# Altium schematic sheet mcu.SchDoc
size A3; Scale: 1:1; DocumentType: Схема электрическая принципиальная; FirstReferrence: АБВГ.123456.001
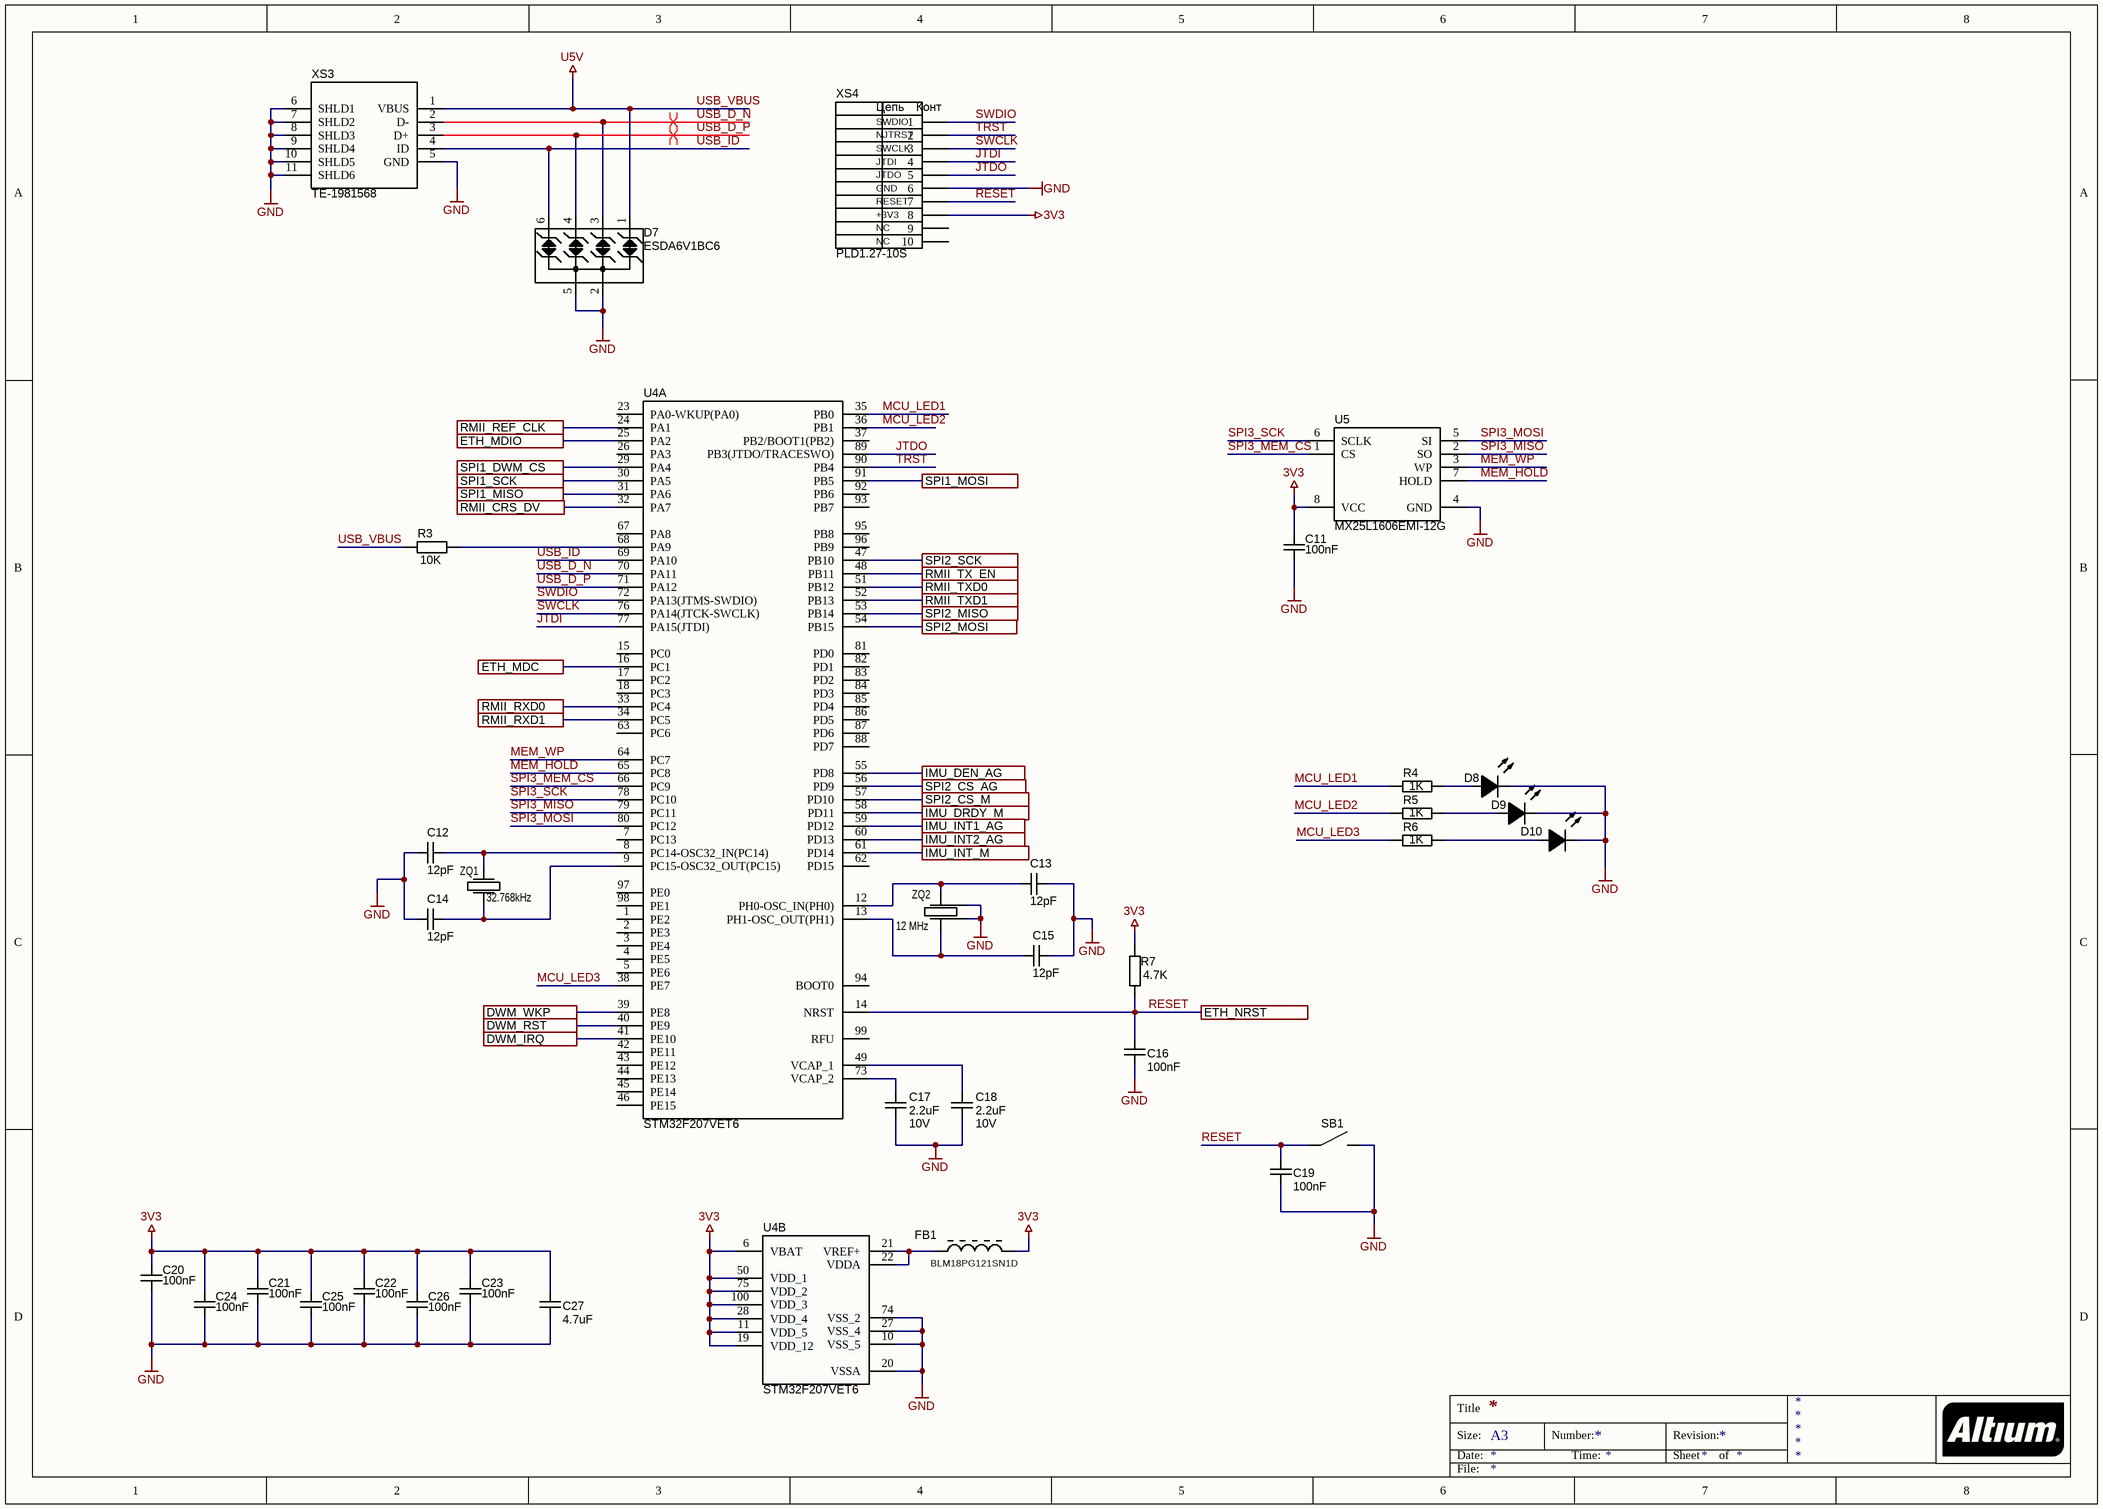
[diagram p0: mcu.SchDoc]

## Parts
C11  value 100nF  [C0603]  (hidden comment: C0603)
C12  value 12pF  [C0603]  (hidden comment: C0603)
C13  value 12pF  [C0603]  (hidden comment: C0603)
C14  value 12pF  [C0603]  (hidden comment: C0603)
C15  value 12pF  [C0603]  (hidden comment: C0603)
C16  value 100nF  [C0603]  (hidden comment: C0603)
C17  value 2.2uF  Voltage: 10V  [C1206(3216)]  (hidden comment: C1206)
C18  value 2.2uF  Voltage: 10V  [C1206(3216)]  (hidden comment: C1206)
C19  value 100nF  [C0603]  (hidden comment: C0603)
C20  value 100nF  [C0603]  (hidden comment: C0603)
C21  value 100nF  [C0603]  (hidden comment: C0603)
C22  value 100nF  [C0603]  (hidden comment: C0603)
C23  value 100nF  [C0603]  (hidden comment: C0603)
C24  value 100nF  [C0603]  (hidden comment: C0603)
C25  value 100nF  [C0603]  (hidden comment: C0603)
C26  value 100nF  [C0603]  (hidden comment: C0603)
C27  value 4.7uF  [C0603]  (hidden comment: C0603)
D7  ESDA6V1BC6  [SOT-23-6]
D8  LED0805  [LED0805]  (value not drawn)
D9  LED0805  [LED0805]  (value not drawn)
D10  LED0805  [LED0805]  (value not drawn)
FB1  BLM18PG121SN1D  [BLM18]
R3  value 10K  [SMD0603]
R4  1K  [SMD0603]
R5  value 1K  [SMD0603]
R6  value 1K  [SMD0603]
R7  value 4.7K  [SMD0603]  (hidden comment: R0603)
SB1  FSMSM  [FSMSM-2]  (value not drawn)
U4  STM32F207VET6  [STM-LQFP100_V]  (parts A,B of 2)
U5  MX25L1606EMI-12G  [SOP-8]
XS3  TE-1981568  [TECO-1981568-5_V]
XS4  PLD1.27-10S  [PLD1.27-10S]
ZQ1  32.768kHz  [DST210A]
ZQ2  12 MHz  [NX3225]

## Ports
DWM_IRQ, DWM_RST, DWM_WKP, ETH_MDC, ETH_MDIO, ETH_NRST, IMU_DEN_AG, IMU_DRDY_M, IMU_INT1_AG, IMU_INT2_AG, IMU_INT_M, RMII_CRS_DV, RMII_REF_CLK, RMII_RXD0, RMII_RXD1, RMII_TX_EN, RMII_TXD0, RMII_TXD1, SPI1_DWM_CS, SPI1_MISO, SPI1_MOSI, SPI1_SCK, SPI2_CS_AG, SPI2_CS_M, SPI2_MISO, SPI2_MOSI, SPI2_SCK

## Nets
3V3: C11.2 C20.2 C21.2 C22.2 C23.2 C24.2 C25.2 C26.2 C27.1 FB1.2 R7.2 U4.6(VBAT) U4.11(VDD_5) U4.19(VDD_12) U4.28(VDD_4) U4.50(VDD_1) U4.75(VDD_2) U4.100(VDD_3) U5.8(VCC) XS4.8
GND: C11.1 C12.1 C13.2 C14.1 C15.2 C16.1 C17.1 C18.1 C19.1 C20.1 C21.1 C22.1 C23.1 C24.1 C25.1 C26.1 C27.2 D7.2(IO2) D7.5(IO4) D8.1(K) D9.1(K) D10.1(K) SB1.2 U4.10(VSS_5) U4.20(VSSA) U4.27(VSS_4) U4.74(VSS_2) U5.4(GND) XS3.5(GND) XS3.6(SHLD1) XS3.7(SHLD2) XS3.8(SHLD3) XS3.9(SHLD4) XS3.10(SHLD5) XS3.11(SHLD6) XS4.6 ZQ2.2 ZQ2.4
USB_VBUS: D7.1(IO1) R3.1 XS3.1(VBUS)  [also labelled U5V]
DWM_IRQ: U4.41(PE10) ; port DWM_IRQ
DWM_RST: U4.40(PE9) ; port DWM_RST
DWM_WKP: U4.39(PE8) ; port DWM_WKP
ETH_MDC: U4.16(PC1) ; port ETH_MDC
ETH_MDIO: U4.25(PA2) ; port ETH_MDIO
IMU_DEN_AG: U4.55(PD8) ; port IMU_DEN_AG
IMU_DRDY_M: U4.58(PD11) ; port IMU_DRDY_M
IMU_INT1_AG: U4.59(PD12) ; port IMU_INT1_AG
IMU_INT2_AG: U4.60(PD13) ; port IMU_INT2_AG
IMU_INT_M: U4.61(PD14) ; port IMU_INT_M
JTDI: U4.77(PA15(JTDI)) XS4.4
JTDO: U4.89(PB3(JTDO/TRACESWO)) XS4.5
MCU_LED1: R4.2 U4.35(PB0)
MCU_LED2: R5.2 U4.36(PB1)
MCU_LED3: R6.2 U4.38(PE7)
MEM_HOLD: U4.65(PC8) U5.7(HOLD)
MEM_WP: U4.64(PC7) U5.3(WP)
RESET: C16.2 C19.2 R7.1 SB1.1 U4.14(NRST) XS4.7 ; port ETH_NRST
RMII_CRS_DV: U4.32(PA7) ; port RMII_CRS_DV
RMII_REF_CLK: U4.24(PA1) ; port RMII_REF_CLK
RMII_RXD0: U4.33(PC4) ; port RMII_RXD0
RMII_RXD1: U4.34(PC5) ; port RMII_RXD1
RMII_TX_EN: U4.48(PB11) ; port RMII_TX_EN
RMII_TXD0: U4.51(PB12) ; port RMII_TXD0
RMII_TXD1: U4.52(PB13) ; port RMII_TXD1
SPI1_DWM_CS: U4.29(PA4) ; port SPI1_DWM_CS
SPI1_MISO: U4.31(PA6) ; port SPI1_MISO
SPI1_MOSI: U4.91(PB5) ; port SPI1_MOSI
SPI1_SCK: U4.30(PA5) ; port SPI1_SCK
SPI2_CS_AG: U4.56(PD9) ; port SPI2_CS_AG
SPI2_CS_M: U4.57(PD10) ; port SPI2_CS_M
SPI2_MISO: U4.53(PB14) ; port SPI2_MISO
SPI2_MOSI: U4.54(PB15) ; port SPI2_MOSI
SPI2_SCK: U4.47(PB10) ; port SPI2_SCK
SPI3_MEM_CS: U4.66(PC9) U5.1(CS)
SPI3_MISO: U4.79(PC11) U5.2(SO)
SPI3_MOSI: U4.80(PC12) U5.5(SI)
SPI3_SCK: U4.78(PC10) U5.6(SCLK)
SWCLK: U4.76(PA14(JTCK-SWCLK)) XS4.3
SWDIO: U4.72(PA13(JTMS-SWDIO)) XS4.1
TRST: U4.90(PB4) XS4.2
USB_D_N: D7.3(GND) U4.70(PA11) XS3.2(D-)
USB_D_P: D7.4(IO3) U4.71(PA12) XS3.3(D+)
USB_ID: D7.6(NC) U4.69(PA10) XS3.4(ID)
NetC12_2: C12.2 U4.8(PC14-OSC32_IN(PC14)) ZQ1.2(OSC2)
NetC13_1: C13.1 U4.12(PH0-OSC_IN(PH0)) ZQ2.3
NetC14_2: C14.2 U4.9(PC15-OSC32_OUT(PC15)) ZQ1.1(OSC1)
NetC15_1: C15.1 U4.13(PH1-OSC_OUT(PH1)) ZQ2.1
NetC17_2: C17.2 U4.73(VCAP_2)
NetC18_2: C18.2 U4.49(VCAP_1)
NetD8_2: D8.2(A) R4.1
NetD9_2: D9.2(A) R5.1
NetD10_2: D10.2(A) R6.1
NetFB1_1: FB1.1 U4.21(VREF+) U4.22(VDDA)
NetR3_2: R3.2 U4.68(PA9)

Not connected (* = marked no-connect by the designer): U4 1(PE2) 2(PE3) 3(PE4) 4(PE5) 5(PE6) 7(PC13) 15(PC0) 17(PC2) 18(PC3) 23(PA0-WKUP(PA0)) 26(PA3) 37(PB2/BOOT1(PB2)) 42(PE11) 43(PE12) 44(PE13) 45(PE14) 46(PE15) 62(PD15) 63(PC6) 67(PA8) 81(PD0) 82(PD1) 83(PD2) 84(PD3) 85(PD4) 86(PD5) 87(PD6) 88(PD7) 92(PB6) 93(PB7) 94(BOOT0) 95(PB8) 96(PB9) 97(PE0) 98(PE1) 99(RFU); XS4 9 10

## Layout directives
differential pair: USB_D_N, USB_D_P

## Notes on the sheet
- Title
- Size:
- Date:
- A3
- Number:
- Time:
- Revision:
- Sheet
- of
- File:
- (in symbol PLD1.27-10-MCU) Цепь; Конт; SWDIO; NJTRST; SWCLK; JTDI; JTDO; GND; RESET; +3V3; NC

## Library data of the parts
C11 C13 C15 C16 C19-C27 = C0603: Voltage: 10V; Model: *
C12 C14 = C0603: Voltage: *V; Model: *
C17 C18 = C1206: Model: CC1206KKX7R6BB225
D7 = ESDA6V1BC6: 4-line ESD protection; Manuf_1: STM; Manuf_Part_1: ESDA5V3L; Ref St: 9179034; Provided: ST; ECCN_US/EU: EAR99/NEC; Distrib: ST; Order: ESDA5V3L; Ordered by: STM
D8-D10 = LED0805: LED SMD 0805 K1A2
FB1 = BLM18: Ferrite Bead 0603; Resistance: * Ohm; DC Current Rating: * A
R3-R6 = R0603
  R4: Value: 1K
SB1 = FSMSM: SMD Switch 2-Leads
U5 = MX25L1606EMI-12G: FLASH 16M SPI 86MHZ 16SOP
XS3 = USB-Micro B
XS4 = PLD1.27-10-MCU
ZQ1 = Crystal: DST210A
ZQ2 = Crystal_4: DSX321G